# Altium schematic sheet RFFE.SchDoc
size A3; DocumentNumber: 5; Revision: B; SheetNumber: 5; SheetTotal: 7; SheetTitle: RF Front-End; Designer: DM; Reviewer: -
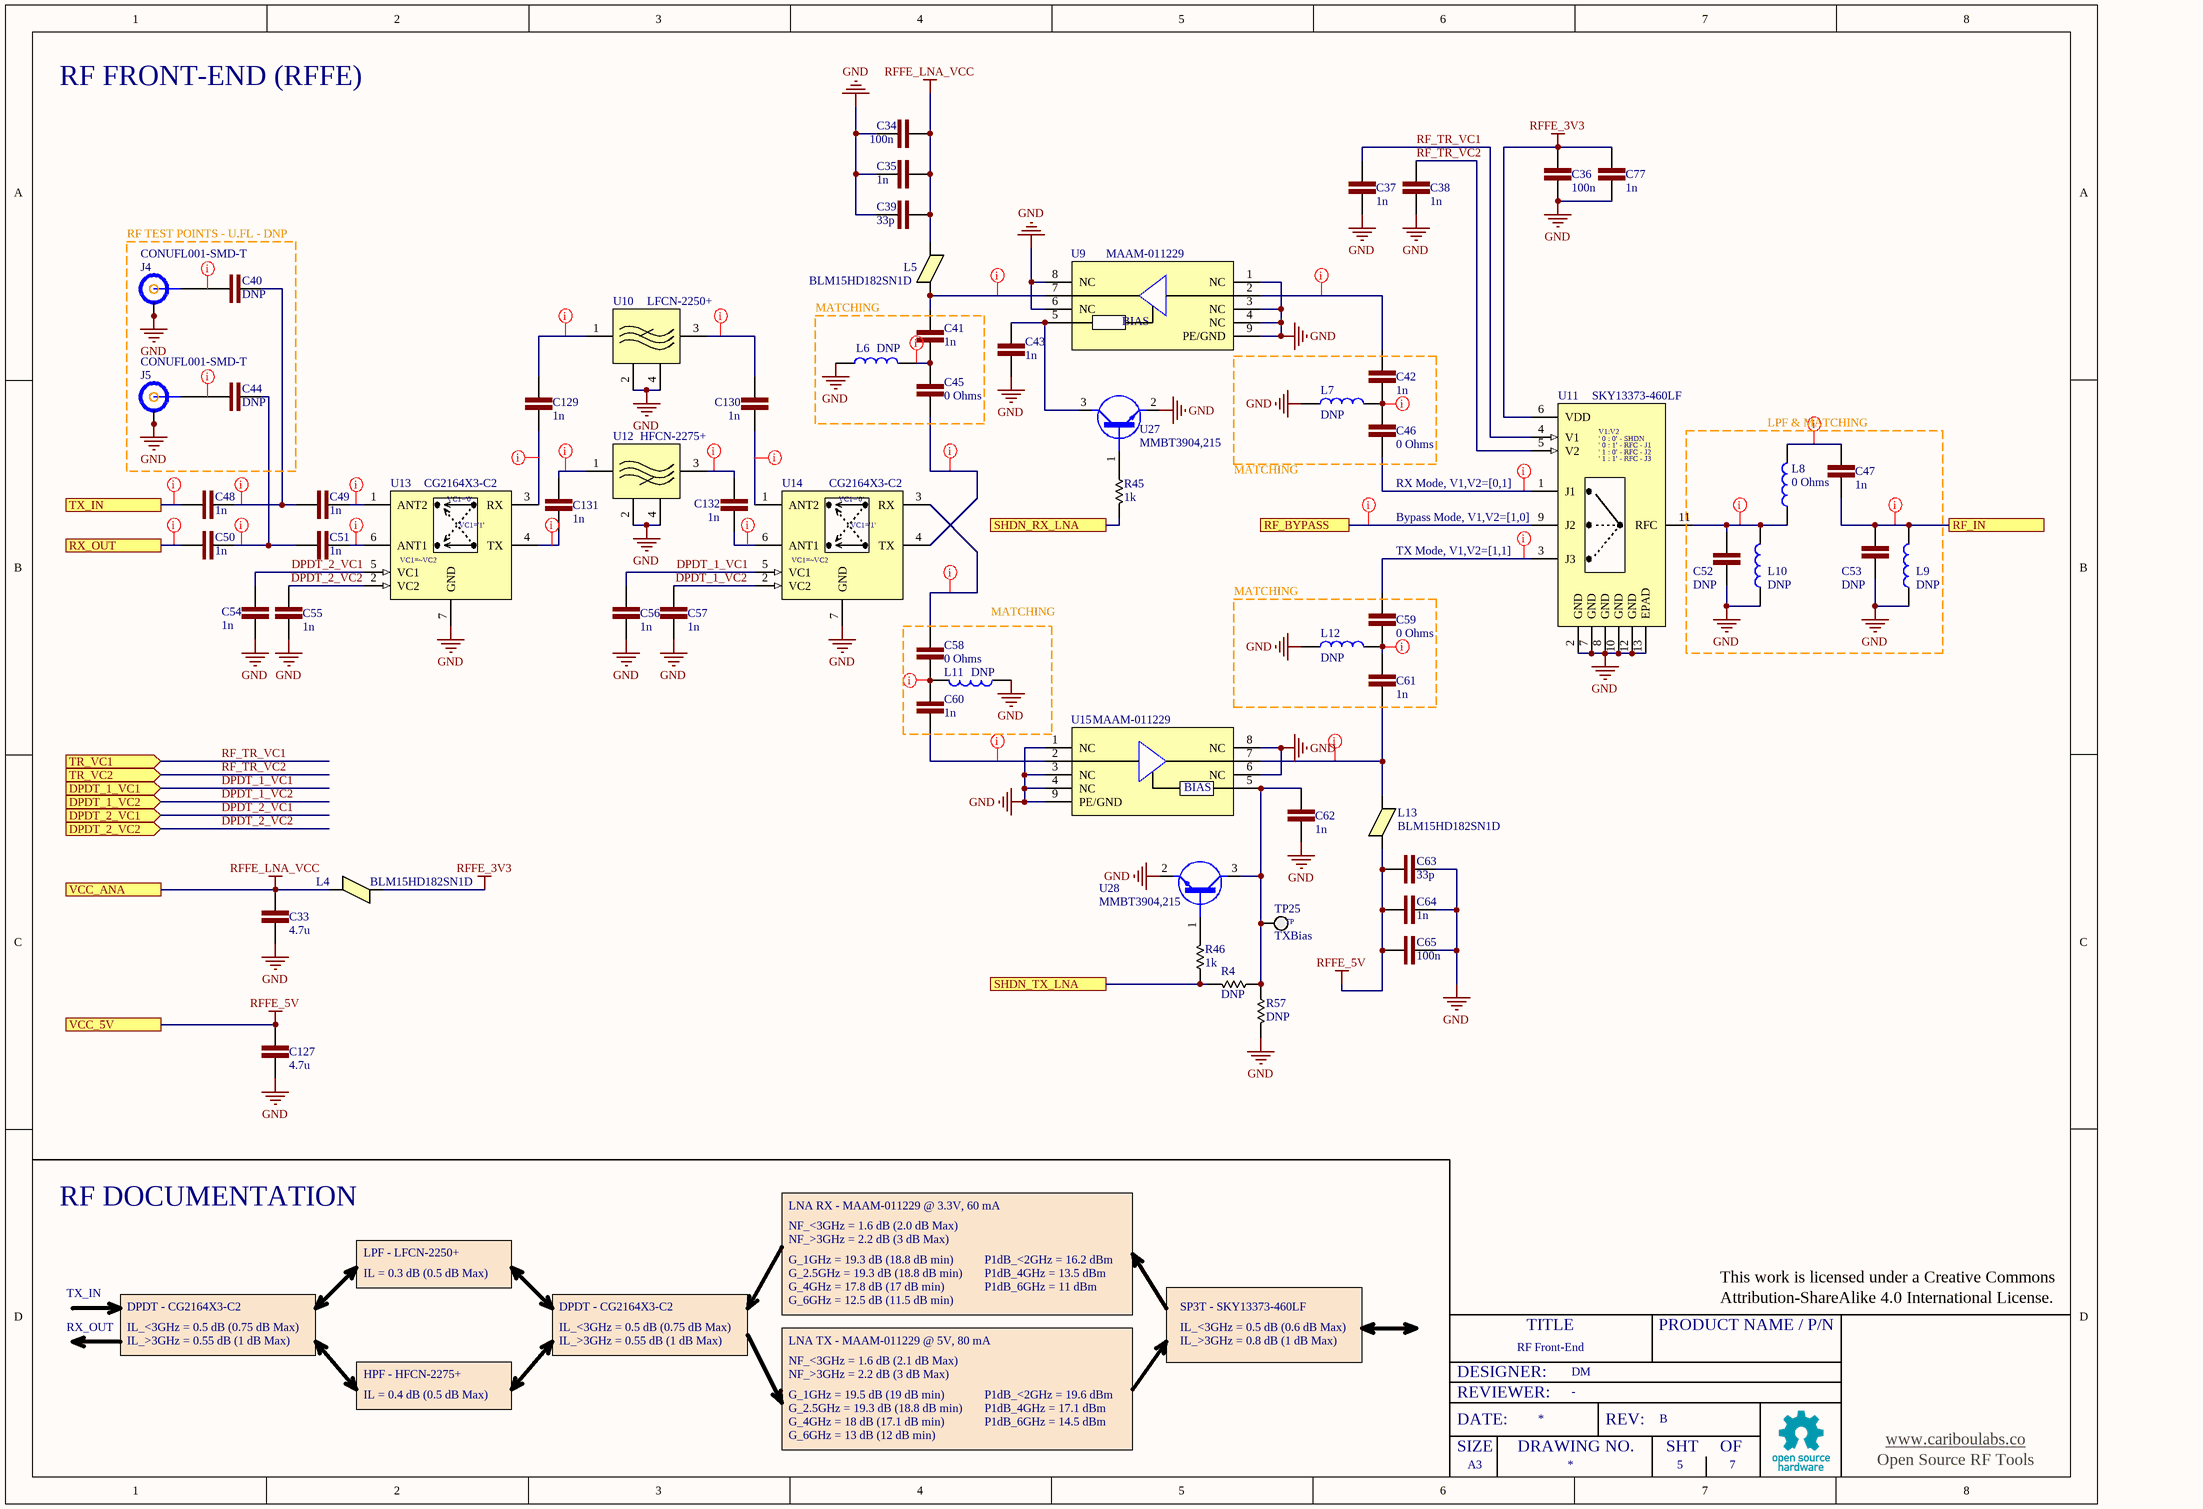
[diagram p0: RFFE.SchDoc]

## Parts
C33  4.7u  [MURATA 0402]
C34  100n  [MURATA 0402]
C35  1n  [MURATA 0402]
C36  100n  [MURATA 0402]
C37  1n  [MURATA 0402]
C38  1n  [MURATA 0402]
C39  33p  [MURATA 0402]
C40  DNP  [MURATA 0402]
C41  1n  [MURATA 0402]
C42  1n  [MURATA 0402]
C43  1n  [MURATA 0402]
C44  DNP  [MURATA 0402]
C45  0 Ohms  [MURATA 0402]
C46  0 Ohms  [MURATA 0402]
C47  1n  [MURATA 0402]
C48  1n  [MURATA 0402]
C49  1n  [MURATA 0402]
C50  1n  [MURATA 0402]
C51  1n  [MURATA 0402]
C52  DNP  [MURATA 0402]
C53  DNP  [MURATA 0402]
C54  1n  [MURATA 0402]
C55  1n  [MURATA 0402]
C56  1n  [MURATA 0402]
C57  1n  [MURATA 0402]
C58  0 Ohms  [MURATA 0402]
C59  0 Ohms  [MURATA 0402]
C60  1n  [MURATA 0402]
C61  1n  [MURATA 0402]
C62  1n  [MURATA 0402]
C63  33p  [MURATA 0402]
C64  1n  [MURATA 0402]
C65  100n  [MURATA 0402]
C77  1n  [MURATA 0402]
C127  4.7u  [MURATA 0402]
C129  1n  [MURATA 0402]
C130  1n  [MURATA 0402]
C131  1n  [MURATA 0402]
C132  1n  [MURATA 0402]
J4  CONUFL001-SMD-T  [LINX_CONUFL001-SMD-T]
J5  CONUFL001-SMD-T  [LINX_CONUFL001-SMD-T]
L4  BLM15HD182SN1D  [0402 FERRITE BEAD]
L5  BLM15HD182SN1D  [0402 FERRITE BEAD]
L6  DNP  [CoilCraft 0402]
L7  DNP  [CoilCraft 0402]
L8  0 Ohms  [CoilCraft 0402]
L9  DNP  [CoilCraft 0402]
L10  DNP  [CoilCraft 0402]
L11  DNP  [CoilCraft 0402]
L12  DNP  [CoilCraft 0402]
L13  BLM15HD182SN1D  [0402 FERRITE BEAD]
R4  DNP  [PANASONIC 0402]
R45  1k  [PANASONIC 0402]
R46  1k  [PANASONIC 0402]
R57  DNP  [PANASONIC 0402]
TP25  TXBias  [TP_40]
U9  MAAM-011229  [PDFN_2MM_8LEAD]
U10  LFCN-2250+  [FV1206]
U11  SKY13373-460LF  [QFN50P200X200X60-13N-D]
U12  HFCN-2275+  [FV1206]
U13  CG2164X3-C2  [SON50P150X150X40-7N]
U14  CG2164X3-C2  [SON50P150X150X40-7N]
U15  MAAM-011229  [PDFN_2MM_8LEAD]
U27  MMBT3904,215  [SOT95P240X111-3N]
U28  MMBT3904,215  [SOT95P240X111-3N]

## Blocks framed on the sheet
RF TEST POINTS - U.FL - DNP: C40 C44 J4 J5
MATCHING: C41 C45 L6
LPF & MATCHING: C47 C52 C53 L8-L10
MATCHING: C59 C61 L12
MATCHING: C58 C60 L11

## Ports
DPDT_1_VC1 (in), DPDT_1_VC2 (in), DPDT_2_VC1 (in), DPDT_2_VC2 (in), RF_BYPASS, RF_IN, RX_OUT, SHDN_RX_LNA, SHDN_TX_LNA, TR_VC1 (in), TR_VC2 (in), TX_IN, VCC_5V, VCC_ANA

## Nets
GND: C33.2 C34.1 C35.1 C36.1 C37.2 C38.2 C39.1 C43.1 C52.1 C53.1 C54.1 C55.1 C56.1 C57.1 C62.1 C63.2 C64.1 C65.1 C77.1 C127.1 J4.2(OUTER) J4.3(OUTER) J5.2(OUTER) J5.3(OUTER) L6.1 L7.1 L9.1 L10.1 L11.1 L12.1 R57.1 U9.1(NC) U9.3(NC) U9.4(NC) U9.6(NC) U9.8(NC) U9.9(PE/GND) U10.2 U10.4 U11.2(GND) U11.7(GND) U11.8(GND) U11.10(GND) U11.12(GND) U11.13(EPAD) U12.2 U12.4 U13.7(GND) U14.7(GND) U15.1(NC) U15.3(NC) U15.4(NC) U15.6(NC) U15.8(NC) U15.9(PE/GND) U27.2(E) U28.2(E)
RFFE_3V3: C36.2 C77.2 L4.2 U11.6(VDD)
RFFE_5V: C63.1 C64.2 C65.2 C127.2 L13.1 ; port VCC_5V
RFFE_LNA_VCC: C33.1 C34.2 C35.2 C39.2 L4.1 L5.1 ; port VCC_ANA
DPDT_1_VC1: C56.2 U14.5(VC1) ; port DPDT_1_VC1
DPDT_1_VC2: C57.2 U14.2(VC2) ; port DPDT_1_VC2
DPDT_2_VC1: C54.2 U13.5(VC1) ; port DPDT_2_VC1
DPDT_2_VC2: C55.2 U13.2(VC2) ; port DPDT_2_VC2
RF_BYPASS: U11.9(J2) ; port RF_BYPASS
RF_IN: C47.2 C53.2 L9.2 ; port RF_IN
RF_TR_VC1: C37.1 U11.4(V1) ; port TR_VC1
RF_TR_VC2: C38.1 U11.5(V2) ; port TR_VC2
RX_OUT: C50.2 ; port RX_OUT
SHDN_RX_LNA: R45.2 ; port SHDN_RX_LNA
SHDN_TX_LNA: R4.1 R46.2 ; port SHDN_TX_LNA
TX_IN: C48.2 ; port TX_IN
NetC40_1: C40.1 C48.1 C49.2
NetC40_2: C40.2 J4.1(INNER)
NetC41_1: C41.1 C45.2 L6.2
NetC41_2: C41.2 L5.2 U9.7
NetC42_1: C42.1 C46.2 L7.2
NetC42_2: C42.2 U9.2
NetC43_2: C43.2 U9.5 U27.3(C)
NetC44_1: C44.1 C50.1 C51.2
NetC44_2: C44.2 J5.1(INNER)
NetC45_1: C45.1 U14.4(TX)
NetC46_1: C46.1 U11.1(J1)
NetC47_1: C47.1 L8.2
NetC49_1: C49.1 U13.1(ANT2)
NetC51_1: C51.1 U13.6(ANT1)
NetC52_2: C52.2 L8.1 L10.2 U11.11(RFC)
NetC58_1: C58.1 C60.2 L11.2
NetC58_2: C58.2 U14.3(RX)
NetC59_1: C59.1 C61.2 L12.2
NetC59_2: C59.2 U11.3(J3)
NetC60_1: C60.1 U15.2
NetC61_1: C61.1 L13.2 U15.7
NetC62_2: C62.2 R4.2 R57.2 TP25.1(TP) U15.5 U28.3(C)
NetC129_1: C129.1 U10.1
NetC129_2: C129.2 U13.3(RX)
NetC130_1: C130.1 U10.3
NetC130_2: C130.2 U14.1(ANT2)
NetC131_1: C131.1 U12.1
NetC131_2: C131.2 U13.4(TX)
NetC132_1: C132.1 U12.3
NetC132_2: C132.2 U14.6(ANT1)
NetR45_1: R45.1 U27.1(B)
NetR46_1: R46.1 U28.1(B)

## Layout directives
net class RF50OHM: NetC40_1, NetC40_2, NetC41_1, NetC41_2, NetC42_1, NetC42_2, NetC44_1, NetC44_2, NetC45_1, NetC46_1, NetC47_1, NetC49_1, NetC51_1, NetC52_2, NetC58_1, NetC58_2, NetC59_1, NetC59_2, NetC60_1, NetC61_1, NetC129_1, NetC129_2, NetC130_1, NetC130_2, NetC131_1, NetC131_2, NetC132_1, NetC132_2, RF_BYPASS, RF_IN, RX_OUT, TX_IN

## Notes on the sheet
- RF FRONT-END (RFFE)
- MATCHING
- RX Mode, V1,V2=[0,1]
- (near U11) Bypass Mode, V1,V2=[1,0]
- TX Mode, V1,V2=[1,1]
- RF DOCUMENTATION
- LPF - LFCN-2250+
- LNA RX - MAAM-011229 @ 3.3V, 60 mA
- NF_>3GHz = 2.2 dB (3 dB Max)
- NF_<3GHz = 1.6 dB (2.0 dB Max)
- G_1GHz = 19.3 dB (18.8 dB min)
- P1dB_<2GHz = 16.2 dBm
- TX_IN
- DPDT - CG2164X3-C2
- IL = 0.3 dB (0.5 dB Max)
- G_2.5GHz = 19.3 dB (18.8 dB min)
- G_6GHz = 12.5 dB (11.5 dB min)
- G_4GHz = 17.8 dB (17 dB min)
- P1dB_4GHz = 13.5 dBm
- P1dB_6GHz = 11 dBm
- SP3T - SKY13373-460LF
- This work is licensed under a Creative Commons
- Attribution-ShareAlike 4.0 International License.
- RX_OUT
- IL_>3GHz = 0.55 dB (1 dB Max)
- IL_<3GHz = 0.5 dB (0.75 dB Max)
- HPF - HFCN-2275+
- IL = 0.4 dB (0.5 dB Max)
- LNA TX - MAAM-011229 @ 5V, 80 mA
- NF_<3GHz = 1.6 dB (2.1 dB Max)
- G_1GHz = 19.5 dB (19 dB min)
- P1dB_<2GHz = 19.6 dBm
- IL_>3GHz = 0.8 dB (1 dB Max)
- IL_<3GHz = 0.5 dB (0.6 dB Max)
- G_6GHz = 13 dB (12 dB min)
- G_4GHz = 18 dB (17.1 dB min)
- P1dB_4GHz = 17.1 dBm
- P1dB_6GHz = 14.5 dBm
- DESIGNER:
- REVIEWER:
- TITLE
- PRODUCT NAME / P/N
- SIZE
- DATE:
- DRAWING NO.
- REV:
- SHT
- OF
- www.cariboulabs.co
- A3
- Open Source RF Tools
- (in symbol CG2164X3-C2) VC1='0'; VC1='1'; VC1=~VC2
- (in symbol MAAM-011229) BIAS
- (in symbol SKY13373-460LF) V1:V2; ' 0 : 0' - SHDN; ' 0 : 1' - RFC - J1; ' 1 : 0' - RFC - J2; ' 1 : 1' - RFC - J3

## Library data of the parts
C33 C127 = Capacitor: Multilayer Ceramic Capacitors MLCC - SMD/SMT 0402 MLCC X5R 4.7 uF +/ -20% 10V; Tolerance: 20%; Manu. P/N: GRJ155R61A475ME11J; Temp. Range: [-55, 85]; SRF: TBD [GHz]; Initial Voltage: 0; Vmax: 10V; Technology: X5R; VALUE: 4.7u
C34 C36 C65 = Capacitor: Multilayer Ceramic Capacitors MLCC - SMD/SMT 16V .1uF X5R 0402 10%; Manu. P/N: 0402YD104KAT2A; Temp. Range: [-55, 85]; SRF: TBD [GHz]; Initial Voltage: 0; Tolerance: 10%; Vmax: 16V; Technology: X5R; VALUE: 100n
C35 C37 C38 C40-C44 C47-C51 C54-C57 C60-C62 C64 C77 C129-C132 = Capacitor: Multilayer Ceramic Capacitors MLCC 1000pF ±5% 100V C0G 0402; Manu. P/N: GRM1555C2A102JE01D; Temp. Range: [-40, 125]; SRF: TBD [GHz]; Initial Voltage: 0; Tolerance: 5%; Vmax: 100V; Technology: C0G
  C35 C37 C38 C41-C43 C47-C51 C54-C57 C60-C62 C64 C77 C129-C132: VALUE: 1n
  C40 C44: VALUE: DNP
C39 C63 = Capacitor: Multilayer Ceramic Capacitors MLCC - SMD/SMT 0402 50V 33pF C0G 0402 5%; Manu. P/N: C0402C330J5GAC; Temp. Range: [-55, 125]; SRF: TBD [GHz]; Initial Voltage: 0; Tolerance: 5%; Vmax: 50V; Technology: C0G; VALUE: 33p
C45 C46 C58 C59 = Capacitor: 0 Ohms jumper resistor 0402; Tolerance: 5%; Vmax: 100V; Manu. P/N: CRCW04020000Z0EDC; Temp. Range: [-40, 125]; SRF: TBD [GHz]; Initial Voltage: 0; Technology: C0G; VALUE: 0 Ohms
C52 C53 = Capacitor: Tolerance: 5%; Vmax: 10V; Temp. Range: [-40, 125]; SRF: TBD [GHz]; Initial Voltage: 0; Manu. P/N: *; Technology: C0G; VALUE: DNP
J4 J5 = CONUFL001-SMD-T: RF Connectors / Coaxial Connectors U.FL Straight Surface Mount Jack; Manu. P/N: CONUFL001-SMD-T
L4 L5 L13 = BLM15: Ferrite Beads 1800ohms GHz HiSpd; Imax: 0.2 A; Max DC Resistance: 2.2 Ohms; Temp. Range: [-40, 125]; Tolerance: 25%; Impedance @ 100 MHz: 1800 Ohms; Manu. P/N: BLM15HD182SN1D
L6 L7 L9-L12 = Inductor: Tolerance: 5%; DC Imax: TBD [A]; DC Rmax: TBD [Ohm]; SRF: TBD [GHz]; Manu. P/N: *; VALUE: DNP
L8 = Inductor: 0 Ohms jumper resistor 0402; Tolerance: 5%; Manu. P/N: CRCW04020000Z0EDC; DC Imax: TBD [A]; DC Rmax: TBD [Ohm]; SRF: TBD [GHz]; VALUE: 0 Ohms
R4 R57 = Resistor: <1>; Power Rating: 62.5 mW (1/16 W); Temp. Ceoff.: 100 PPM/C; Tolerance: 1%; Manu. P/N: DNP; VALUE: DNP
R45 R46 = Resistor: Thick Film Resistors - SMD 0402 1/16watt 1Kohms 1%; Manu. P/N: CRCW04021K00FKEDC; Power Rating: 62.5 mW (1/16 W); Temp. Ceoff.: 100 PPM/C; Tolerance: 1%; VALUE: 1k
TP25 = TEST_POINT
U9 U15 = MAAM-011229: RF Amplifier .05-4GHz NF 2.2dBmax -40C +85C; Manu. P/N: MAAM-011229
U10 = LFCN-2250+: LTCC Low Pass Filter, DC - 2200 MHz, 50Ω; Manu. P/N: LFCN-2250+
U11 = SKY13373-460LF: RF Switch ICs .1-6.0GHz SP3T IL .45dB @ 2.5GHz; Manu. P/N: SKY13373-460LF
U12 = HFCN-2275+: Signal Conditioning HI PASS FLTR / SURF MT / RoHS; Manu. P/N: HFCN-2275+
U13 U14 = CG2164X3-C2: RF Switch ICs 2.5 and 6GHz DPDT 802.11a/b/g/n/ac; Manu. P/N: CG2164X3-C2
U27 U28 = MMBT3904,215: Bipolar Transistors - BJT TRANS BIPOLAR; Manu. P/N: MMBT3904,215